# Altium schematic sheet arduino_shield.SchDoc: Arduino Shield
size A4; Organization: Badgerloop Electrical; Address1: 133 Engineering Research Building; Address2: 1500 Engineering Drive; Address3: Madison, Wi 53706; SheetNumber: 9
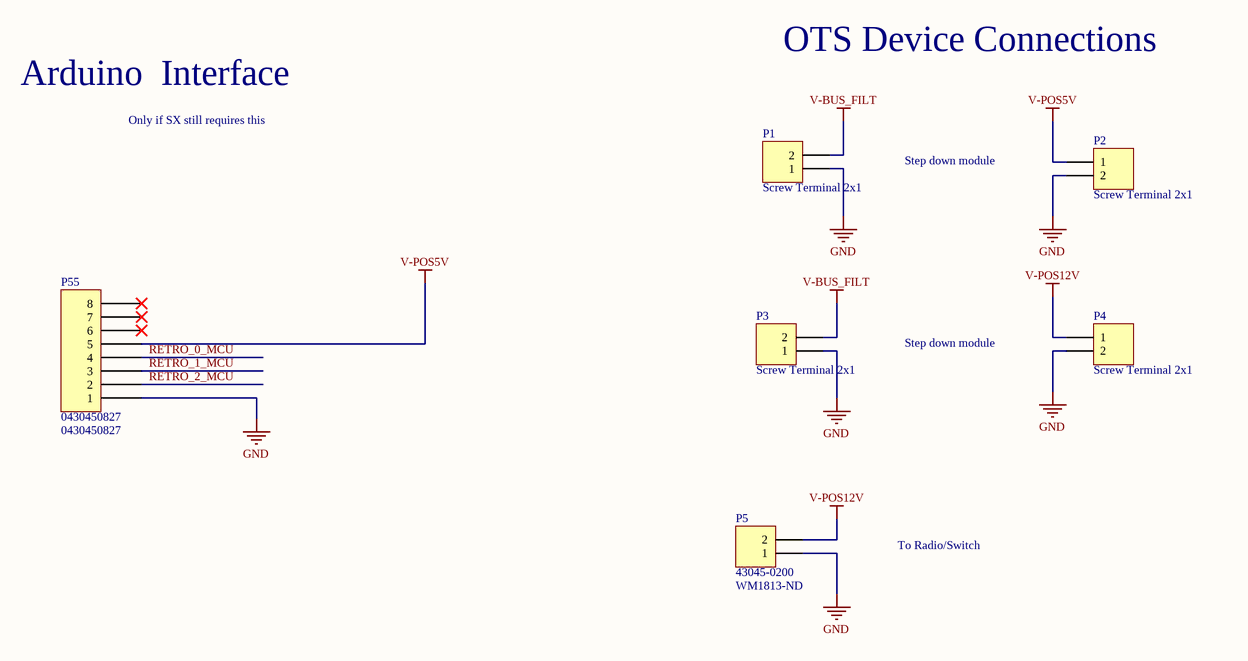
[diagram p0: arduino_shield.SchDoc]

## Parts
P1  Screw Terminal 2x1  [2POS TERM BLOCK]
P2  Screw Terminal 2x1  [2POS TERM BLOCK]
P3  Screw Terminal 2x1  [2POS TERM BLOCK]
P4  Screw Terminal 2x1  [2POS TERM BLOCK]
P5  43045-0200  Supplier Part Number 1: WM1813-ND  [430450200]
P55  0430450827  [0430450827]

## Nets
GND: P1.1 P2.2 P3.1 P4.2 P5.1 P55.1
V-BUS_FILT: P1.2 P3.2
V-POS5V: P2.1 P55.5
V-POS12V: P4.1 P5.2
RETRO_0_MCU: P55.4
RETRO_1_MCU: P55.3
RETRO_2_MCU: P55.2

Not connected (* = marked no-connect by the designer): P55 6* 7* 8*

## Notes on the sheet
- Arduino  Interface
- OTS Device Connections
- Only if SX still requires this
- Step down module
- To Radio/Switch
- Title
- Engineer:
- Date:
- Time:
- Revision:
- Sheet
- of
- File:

## Library data of the parts
P1-P4 = Screw Terminal 2x1: Screw Terminal, 2-Pin
P5 = 43045-0200: CONN HEADER R/A 2POS; Manufacturer: Molex; Contact Resistance: 10mR; Number of Contacts: 2; Voltage Rating: 600V; Current Rating: 5A; Gender: Male; Max Voltage Rating (DC): 250.25kV; Voltage Rating (DC): 250V; Insulation Resistance: 1GR; Pitch: 3mm; Glow Wire Compliant: Compliant; Approvals: UL,CSA,TUV; Supplier 1: Digi-Key; Manufacturer Part Number: 43045-0200; Stock 1: 6320; Pricing 1: 1=0.97000, 10=0.84900, 100=0.73280, 500=0.59958, 1000=0.53296, 5000=0.46634, 10000=0.44302 (USD); RoHS: Yes; Mount: Through Hole; Case/Package: SMC; Contact Plating: Tin; Color: Black; Contact Material: Brass,Tin; Housing Color: Black; Housing Material: Thermoplastic; Material: Thermoplastic; Min Operating Temperature: -40°C; Max Operating Temperature: 105°C; Termination: Through Hole; Number of Rows: 2; Orientation: Right Angle; Packaging: Tray; Number of Positions: 2; Package Quantity: 3168; Number of Circuits: 2; Contact Gender: Male; Diameter: 3mm; Row Spacing: 3mm; Radiation Hardening: No; Flammability Rating: UL94 V-0; REACH SVHC: Unknown; Lead Free: Lead Free; Halogen Free: Low Halogen; ComponentLink1URL: https://datasheet.ciiva.com/14155/04402310-14155203.pdf?src-supplier=Distrelec; ComponentLink1Description: https://datasheet.ciiva.com/14155/04402310-14155203.pdf?src-supplier=Distrelec; ComponentLink2URL: https://datasheet.ciiva.com/19454/883270-19454006.pdf?src-supplier=Jameco; ComponentLink2Description: https://datasheet.ciiva.com/19454/883270-19454006.pdf?src-supplier=Jameco; ComponentLink3URL: https://datasheet.ciiva.com/5150/0430450200-pcb-headers-145770-5150407.pdf?src-supplier=Mouser; ComponentLink3Description: https://datasheet.ciiva.com/5150/0430450200-pcb-headers-145770-5150407.pdf?src-supplier=Mouser; ComponentLink4URL: https://datasheet.ciiva.com/11747/0900766b80027348-11747001.pdf?src-supplier=RSComponents; ComponentLink4Description: https://datasheet.ciiva.com/11747/0900766b80027348-11747001.pdf?src-supplier=RSComponents; ComponentLink5URL: https://datasheet.ciiva.com/16656/0430450200-pcb-headers-16656330.pdf?src-supplier=Avnet+Europe; ComponentLink5Description: https://datasheet.ciiva.com/16656/0430450200-pcb-headers-16656330.pdf?src-supplier=Avnet+Europe; ComponentLink6URL: https://datasheet.ciiva.com/10090/0430450200-pcb-headers-10090299.pdf?src-supplier=Avnet; ComponentLink6Description: https://datasheet.ciiva.com/10090/0430450200-pcb-headers-10090299.pdf?src-supplier=Avnet; ComponentLink7URL: https://datasheet.ciiva.com/36854/124280430450200-pcb-headers-36854331.pdf?src-supplier=Onlinecomponents.com; ComponentLink7Description: https://datasheet.ciiva.com/36854/124280430450200-pcb-headers-36854331.pdf?src-supplier=Onlinecomponents.com; ComponentLink8URL: https://datasheet.ciiva.com/1443/1859921-1443437.pdf?src-supplier=Element14; ComponentLink8Description: https://datasheet.ciiva.com/1443/1859921-1443437.pdf?src-supplier=Element14
P55 = 0430450827: CONN HEADER VERT 8POS 3MM; Manufacturer: Molex; Number of Positions: 8; Contact Resistance: 10mR; Max Voltage Rating (AC): 250V; Connector Type: Male Pin; Row Spacing: 0.118inch; Supplier 1: Digi-Key; Stock 1: 5300; Pricing 1: 1=1.67, 10=1.519, 25=1.4256, 50=1.3636, 100=1.3016, 250=1.17764, 500=1.08466, 1000=0.9297, 2500=0.86772 (USD); Mount: Through Hole; Contact Plating: Tin; Contact Material: Brass; Housing Material: Polymer; Color: Black; Housing Color: Black; Min Operating Temperature: -40°C; Max Operating Temperature: 105°C; Number of Rows: 2; Packaging: Tray; Termination: Solder; Number of Contacts: 8; Orientation: Straight; Package Quantity: 1440; Fastening Type: Ramp; Length: 16.15mm; Pitch: 3mm; Depth: 8.77mm; ComponentLink1URL: http://www.molex.com/pdm_docs/sd/430450827_sd.pdf?src-supplier=Digi-Key; ComponentLink1Description: http://www.molex.com/pdm_docs/sd/430450827_sd.pdf?src-supplier=Digi-Key; Supplier Part Number 1: WM10684-ND; Manufacturer Part Number: 0430450827